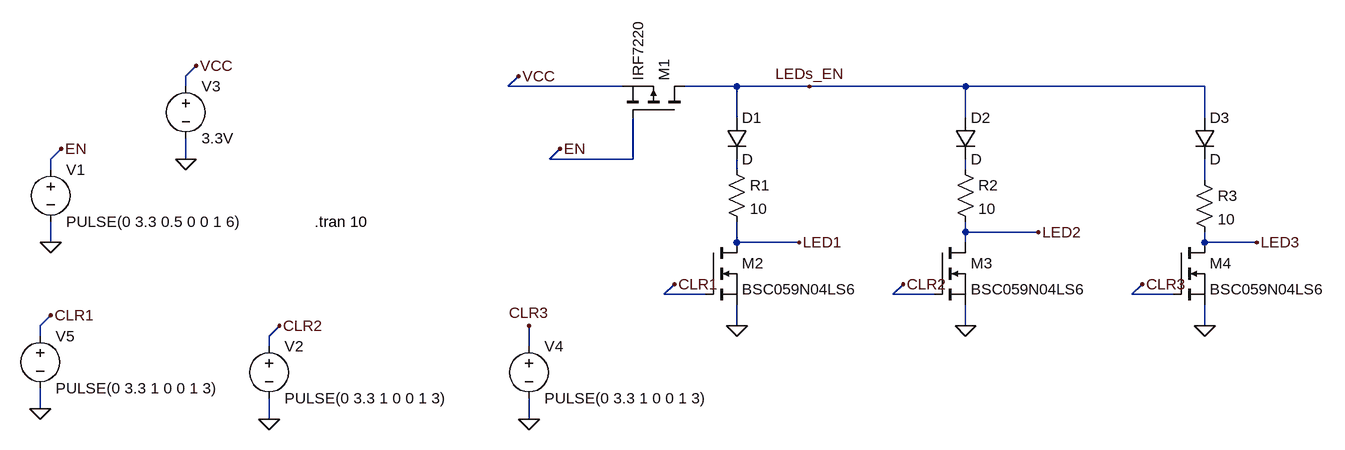
[diagram p0: schematic Draft1.asc]
Draft1.asc, the LTspice schematic file:
Version 4
SHEET 1 1472 680
WIRE -288 -64 -272 -80
WIRE -288 -48 -288 -64
WIRE 208 -48 224 -64
WIRE 384 -48 208 -48
WIRE 560 -48 480 -48
WIRE 672 -48 560 -48
WIRE 912 -48 672 -48
WIRE 1280 -48 912 -48
WIRE 560 0 560 -48
WIRE 912 0 912 -48
WIRE 1280 0 1280 -48
WIRE -496 64 -480 48
WIRE -288 64 -288 32
WIRE 272 64 288 48
WIRE 400 64 400 0
WIRE 400 64 272 64
WIRE -496 80 -496 64
WIRE 560 80 560 64
WIRE 912 80 912 64
WIRE 1280 96 1280 64
WIRE 912 176 912 160
WIRE 1024 176 912 176
WIRE -496 192 -496 160
WIRE 560 192 560 160
WIRE 656 192 560 192
WIRE 912 192 912 176
WIRE 1280 192 1280 176
WIRE 1360 192 1280 192
WIRE 560 208 560 192
WIRE 448 272 464 256
WIRE 512 272 448 272
WIRE 800 272 816 256
WIRE 864 272 800 272
WIRE 1168 272 1184 256
WIRE 1232 272 1168 272
WIRE -512 320 -496 304
WIRE 560 320 560 288
WIRE 912 320 912 288
WIRE 1280 320 1280 288
WIRE -512 336 -512 320
WIRE -160 336 -144 320
WIRE -160 352 -160 336
WIRE 240 352 240 320
WIRE -512 448 -512 416
WIRE -160 464 -160 432
WIRE 240 464 240 432
FLAG -496 192 0
FLAG -480 48 EN
FLAG 560 320 0
FLAG 224 -64 VCC
FLAG -288 64 0
FLAG -272 -80 VCC
FLAG 288 48 EN
FLAG 464 256 CLR1
FLAG 240 464 0
FLAG 240 320 CLR3
FLAG 912 320 0
FLAG 1280 320 0
FLAG -160 464 0
FLAG -144 320 CLR2
FLAG -512 448 0
FLAG -496 304 CLR1
FLAG 816 256 CLR2
FLAG 1184 256 CLR3
FLAG 656 192 LED1
FLAG 1024 176 LED2
FLAG 1360 192 LED3
FLAG 672 -48 LEDs_EN
SYMBOL voltage -496 64 R0
WINDOW 123 0 0 Left 0
WINDOW 39 0 0 Left 0
SYMATTR InstName V1
SYMATTR Value PULSE(0 3.3 0.5 0 0 1 6)
SYMBOL pmos 480 0 M270
SYMATTR InstName M1
SYMATTR Value IRF7220
SYMBOL nmos 512 192 R0
SYMATTR InstName M2
SYMATTR Value BSC059N04LS6
SYMBOL diode 544 0 R0
SYMATTR InstName D1
SYMBOL res 544 64 R0
SYMATTR InstName R1
SYMATTR Value 10
SYMBOL voltage -288 -64 R0
WINDOW 123 0 0 Left 0
WINDOW 39 0 0 Left 0
SYMATTR InstName V3
SYMATTR Value 3.3V
SYMBOL voltage 240 336 R0
WINDOW 123 0 0 Left 0
WINDOW 39 0 0 Left 0
SYMATTR InstName V4
SYMATTR Value PULSE(0 3.3 1 0 0 1 3)
SYMBOL nmos 864 192 R0
SYMATTR InstName M3
SYMATTR Value BSC059N04LS6
SYMBOL diode 896 0 R0
SYMATTR InstName D2
SYMBOL res 896 64 R0
SYMATTR InstName R2
SYMATTR Value 10
SYMBOL nmos 1232 192 R0
SYMATTR InstName M4
SYMATTR Value BSC059N04LS6
SYMBOL diode 1264 0 R0
SYMATTR InstName D3
SYMBOL res 1264 80 R0
SYMATTR InstName R3
SYMATTR Value 10
SYMBOL voltage -160 336 R0
WINDOW 123 0 0 Left 0
WINDOW 39 0 0 Left 0
SYMATTR InstName V2
SYMATTR Value PULSE(0 3.3 1 0 0 1 3)
SYMBOL voltage -512 320 R0
WINDOW 123 0 0 Left 0
WINDOW 39 0 0 Left 0
SYMATTR InstName V5
SYMATTR Value PULSE(0 3.3 1 0 0 1 3)
TEXT -90 160 Left 2 !.tran 10

The netlist it stands for:
* Draft1.asc
V1 EN 0 PULSE(0 3.3 0.5 0 0 1 6)
M1 LEDs_EN EN VCC VCC IRF7220
M2 LED1 CLR1 0 0 BSC059N04LS6
D1 LEDs_EN N001 D
R1 N001 LED1 10
V3 VCC 0 3.3V
V4 CLR3 0 PULSE(0 3.3 1 0 0 1 3)
M3 LED2 CLR2 0 0 BSC059N04LS6
D2 LEDs_EN N002 D
R2 N002 LED2 10
M4 LED3 CLR3 0 0 BSC059N04LS6
D3 LEDs_EN N003 D
R3 N003 LED3 10
V2 CLR2 0 PULSE(0 3.3 1 0 0 1 3)
V5 CLR1 0 PULSE(0 3.3 1 0 0 1 3)
.model D D
.lib standard.dio
.model NMOS NMOS
.model PMOS PMOS
.lib standard.mos
.tran 10
.backanno
.end

* Results of the author's LTspice run, read from the files saved beside the schematic
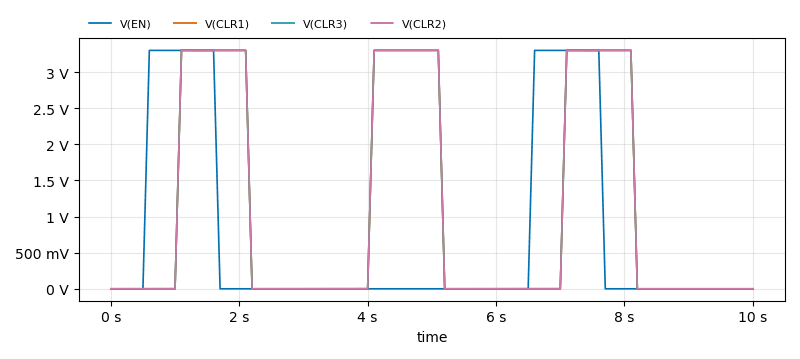
[diagram p1: Transient Analysis of Draft1.asc, plotted from the saved traces]
* Transient Analysis, 1 run:
*   V(EN): min 0 V, max 3.3 V, average 726 mV, rms 1.527 V, last 0 V
*   V(CLR1): min 0 V, max 3.3 V, average 1.089 V, rms 1.868 V, last 0 V
*   V(CLR3): min 0 V, max 3.3 V, average 1.089 V, rms 1.868 V, last 0 V
*   V(CLR2): min 0 V, max 3.3 V, average 1.089 V, rms 1.868 V, last 0 V